# EAGLE design USBCastel (EAGLE 9.1.1)
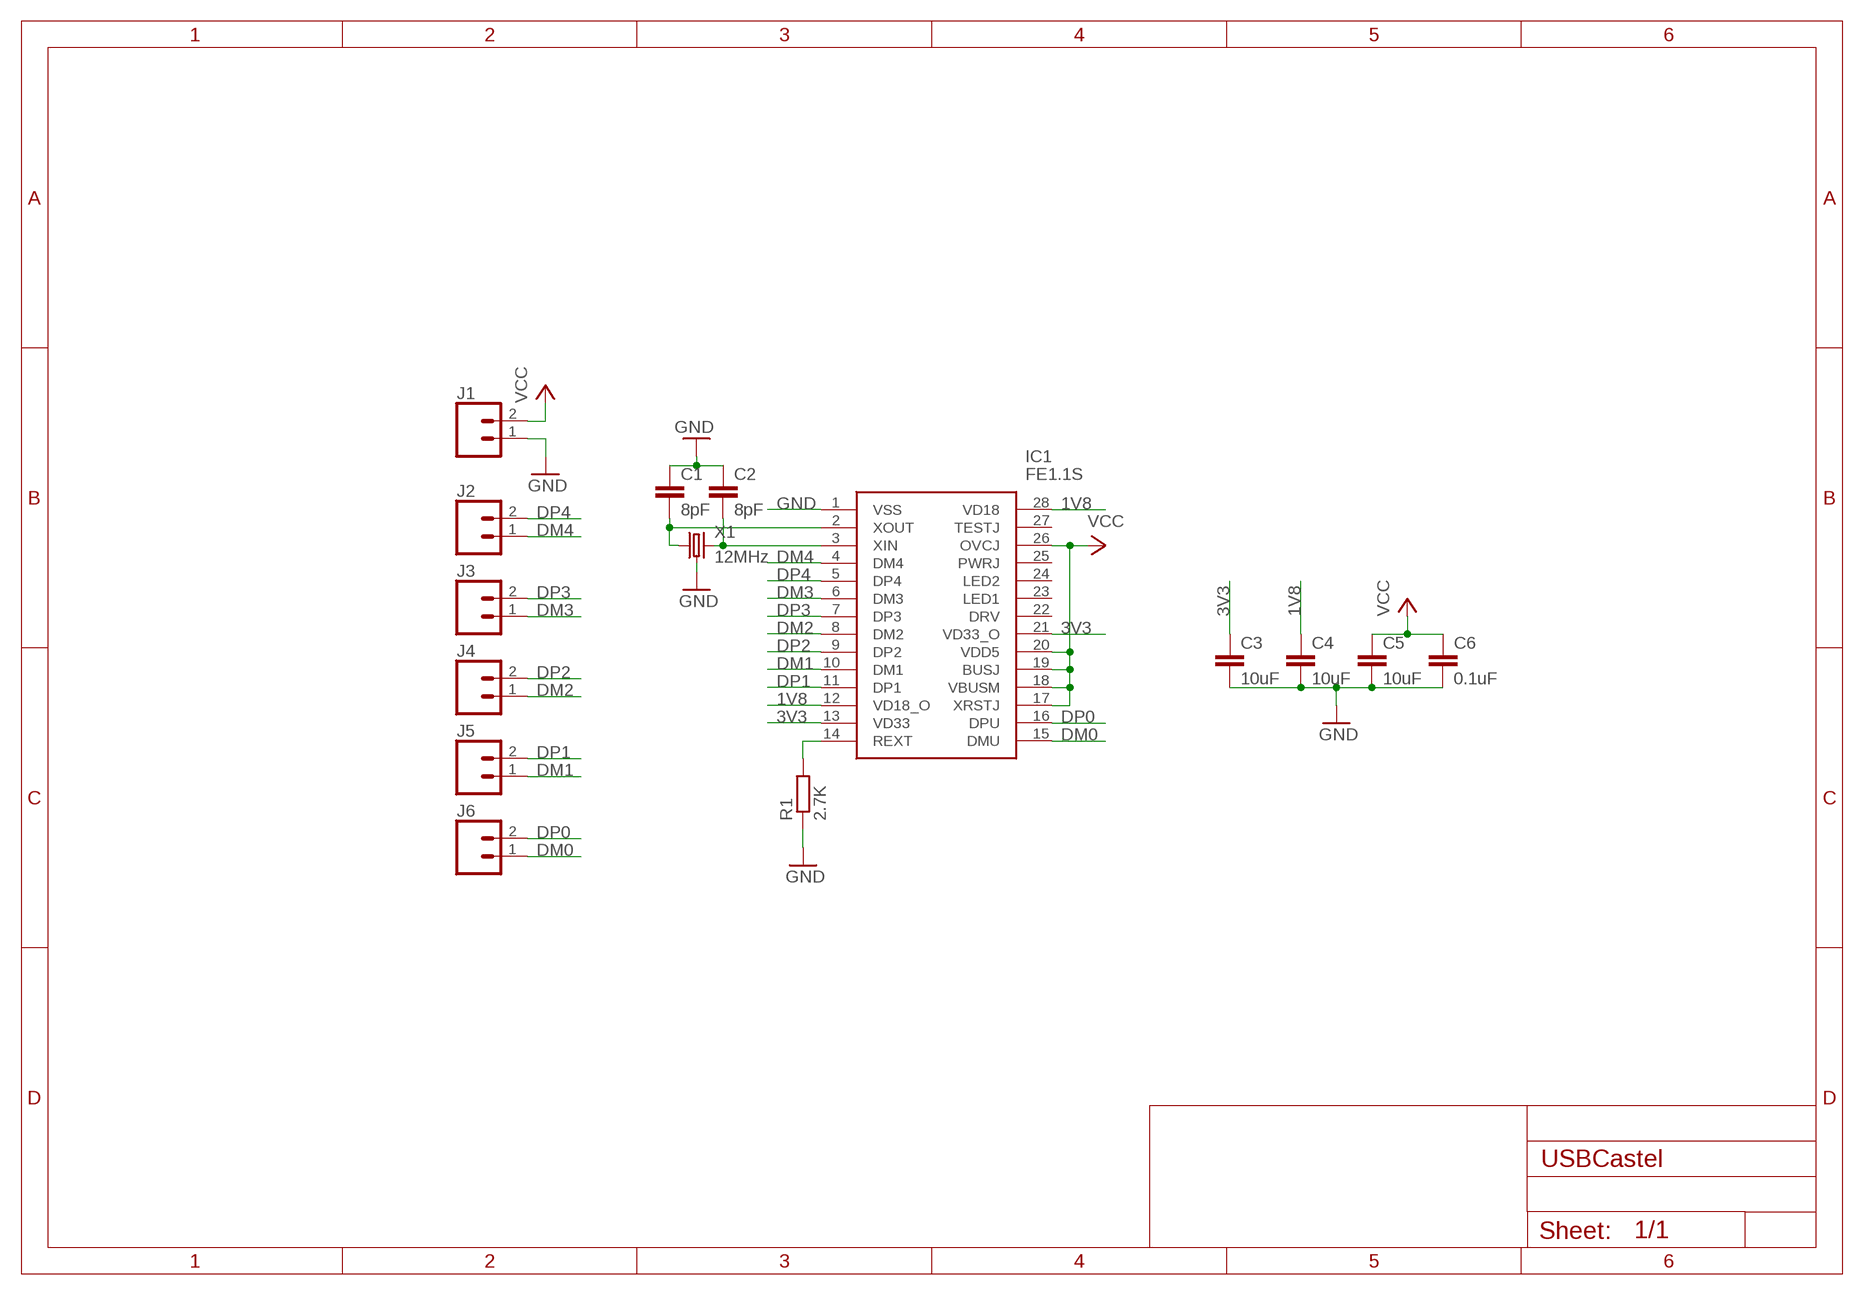
[diagram p0: schematic, sheet 1]

## Parts
C1  8pF  C-EUC0402  [C0402]
C2  8pF  C-EUC0402  [C0402]
C3  10uF  C-EUC0402  [C0402]
C4  10uF  C-EUC0402  [C0402]
C5  10uF  C-EUC0402  [C0402]
C6  0.1uF  C-EUC0402  [C0402]
IC1  FE1.1S  [SOP64P600X175-28N]
J1  CONN_021X02_NO_SILK  [1X02_NO_SILK]
J2  CONN_021X02_NO_SILK  [1X02_NO_SILK]
J3  CONN_021X02_NO_SILK  [1X02_NO_SILK]
J4  CONN_021X02_NO_SILK  [1X02_NO_SILK]
J5  CONN_021X02_NO_SILK  [1X02_NO_SILK]
J6  CONN_021X02_NO_SILK  [1X02_NO_SILK]
R1  2.7K  R-EU_R0402  [R0402]
X1  12MHz  ABM10  [ABM10]

## Nets
1V8: C4.1 IC1.12(VD18_O) IC1.28(VD18)
3V3: C3.1 IC1.13(VD33) IC1.21(VD33_O)
DM0: IC1.15(DMU) J6.1
DM1: IC1.10(DM1) J5.1
DM2: IC1.8(DM2) J4.1
DM3: IC1.6(DM3) J3.1
DM4: IC1.4(DM4) J2.1
DP0: IC1.16(DPU) J6.2
DP1: IC1.11(DP1) J5.2
DP2: IC1.9(DP2) J4.2
DP3: IC1.7(DP3) J3.2
DP4: IC1.5(DP4) J2.2
GND: C1.1 C2.1 C3.2 C4.2 C5.2 C6.2 IC1.1(VSS) J1.1 R1.1 X1.2 X1.4
N$1: C2.2 IC1.3(XIN) X1.3
N$2: C1.2 IC1.2(XOUT) X1.1
N$12: IC1.14(REXT) R1.2
VCC: C5.1 C6.1 IC1.17(XRSTJ) IC1.18(VBUSM) IC1.19(BUSJ) IC1.20(VDD5) IC1.26(OVCJ) J1.2
Unconnected: IC1.22(DRV) IC1.23(LED1) IC1.24(LED2) IC1.25(PWRJ) IC1.27(TESTJ)

## Library data of the parts
C1-C6 = rcl:C-EU: CAPACITOR, European symbol; SPICEPREFIX: C
IC1 = FE1.1S:FE1.1S: USB 2.0 HIGH SPEED 4-PORT HUB CONTROLLER Source: Datasheet <https://cdn-shop.adafruit.com/product-files/2991/FE1.1s Data Sheet (Rev. 1.0).pdf>; ARROW_PART_NUMBER: FE1.1S; DESCRIPTION: USB 2.0 HIGH SPEED 4-PORT HUB CONTROLLER; HEIGHT: 1.75mm; MANUFACTURER_NAME: JFD IC; MANUFACTURER_PART_NUMBER: FE1.1S
J1-J6 = SparkFun-Connectors:CONN_02: Multi connection point. Often used as Generic Header-pin footprint for 0.1 inch spaced/style header connections On any of the 0.1 inch spaced packages, you can populate with these: Break Away Headers - Straight <https://www.sparkfun.com/products/116> (PRT-00116) Break Away Male Headers - Right Angle <https://www.sparkfun.com/products/553> (PRT-00553) Female Headers <https://www.sparkfun.com/products/115> (PRT-00115) Break Away Headers - Machine Pin <https://www.sparkfun.com/products/117> (PRT-00117) Break Away Female Headers - Swiss Machine Pin <https://www.sparkfun.com/products/743> (PRT-00743) For SCREWTERMINALS and SPRING TERMINALS visit here: Screw Terimnals on SparkFun.com <https://www.sparkfun.com/search/results?term=Screw+Terminals> (5mm/3.5mm/2.54mm spacing) This device is also useful as a general connection point to wire up your design to another part of your project. Our various solder wires solder well into these plated through hole pads. Hook-Up Wire - Assortment (Stranded, 22 AWG) <https://www.sparkfun.com/products/11375> (PRT-11375) Hook-Up Wire - Assortment (Solid Core, 22 AWG) <https://www.sparkfun.com/products/11367> (PRT-11367) View the entire wire category on our website here <https://www.sparkfun.com/categories/141> Special notes: Molex polarized connector foot print use with: PRT-08233 with associated crimp pins and housings. 2.54_SCREWTERM for use with PRT-10571. 3.5mm Screw Terminal footprints for PRT-08084 5mm Screw Terminal footprints for use with PRT-08432
R1 = resistor:R-EU_: RESISTOR, European symbol
X1 = USBCastel:ABM10

## Board
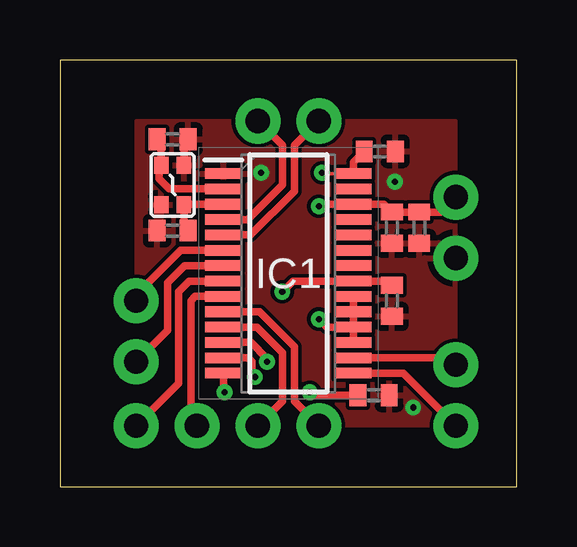
[diagram p1: board, top side]
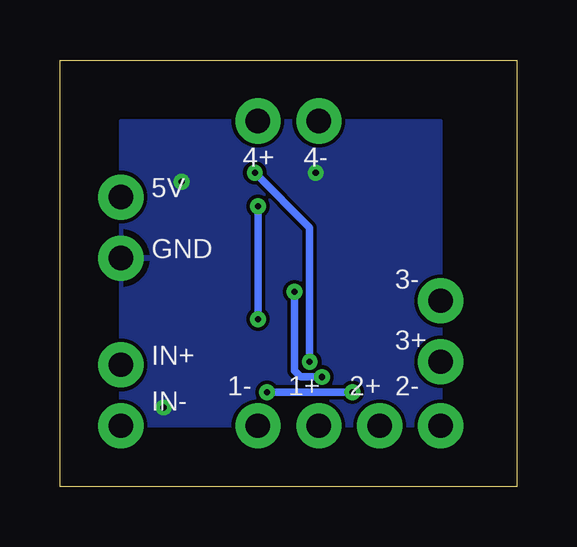
[diagram p2: board, bottom side, seen from below]

Size 19.05 x 17.78 mm. Coordinates in mm from the lower left corner, seen from the top.
Outline: 0,0 19.05,0 19.05,17.78 0,17.78 0,0
Copper layers (1*16): Top 0.035mm / dielectric 1.5mm / Bottom 0.035mm
Design rules "default": minimum track width 6mil, minimum drill 0.35mm, track to track 6mil, track to pad 6mil, pad to pad 6mil, via to via 6mil, smd to smd 6mil, copper to edge 40mil, drill to drill 6mil, minimum pad ring 10mil, minimum via ring 8mil, stop-mask expansion 4mil, vias tented up to drill 0mil, thermal gap 10mil

### Footprints (pad centres in the part's own frame; a part is rotated, then mirrored left to right if it is on the bottom)
C0402 = smd 0.7 x 0.9: 1 -0.65,0; 2 0.65,0
SOP64P600X175-28N = smd 1.525 x 0.44: 1 -2.712,4.16; 2 -2.712,3.52; 3 -2.712,2.88; 4 -2.712,2.24; 5 -2.712,1.6; 6 -2.712,0.96; 7 -2.712,0.32; 8 -2.712,-0.32; 9 -2.712,-0.96; 10 -2.712,-1.6; 11 -2.712,-2.24; 12 -2.712,-2.88; 13 -2.712,-3.52; 14 -2.712,-4.16; 15 2.712,-4.16; 16 2.712,-3.52; 17 2.712,-2.88; 18 2.712,-2.24; 19 2.712,-1.6; 20 2.712,-0.96; 21 2.712,-0.32; 22 2.712,0.32; 23 2.712,0.96; 24 2.712,1.6; 25 2.712,2.24; 26 2.712,2.88; 27 2.712,3.52; 28 2.712,4.16
1X02_NO_SILK = drill 1.016 pad 1.88: 1 0,0; 2 2.54,0
R0402 = smd 0.7 x 0.9: 1 -0.65,0; 2 0.65,0
ABM10 = smd 0.7 x 0.6: 1 -0.825,-0.475; 2 0.825,-0.475; 3 0.825,0.475; 4 -0.825,0.475

### Placement (x,y rotation side)
C1  4.7,14.48 180 top
C2  4.7,10.67 0 top
C3  13.84,7.75 270 top
C4  13.34,13.97 0 top
C5  13.84,10.79 270 top
C6  14.99,10.79 270 top
IC1  9.53,8.89 0 top
J1  16.51,9.53 90 top
J2  8.26,15.24 0 top
J3  3.17,7.75 270 top
J4  3.17,2.54 0 top
J5  10.79,2.54 180 top
J6  16.51,2.54 90 top
R1  13.08,3.81 180 top
X1  4.7,12.57 270 top

### Tracks (layer width: path | path; a pad name or v marks a point on that pad's centre or on a via)
1V8  (via drill 0.25)
  Top 0.152: v10.92,13.08 10.95,13.05 IC1.28
  Top 0.305: IC1.12 7.96,6.01 8.64,5.33 v8.64,5.21 | C4.1 12.24,13.52 IC1.28
  Bottom 0.305: v8.64,5.21 8.64,10.79 v10.92,13.08
3V3  (via drill 0.25)
  Top 0.152: C3.1 13.67,8.57
  Top 0.305: IC1.13 7.84,5.37 8,5.21 8,4.7 v8.13,4.57 | v9.27,8.13 9.71,8.57 IC1.21 13.67,8.57
  Bottom 0.305: v8.13,4.57 9.02,4.57 9.27,4.83 v9.27,8.13
DM0
  Top 0.305: J6.1 14.32,4.73 IC1.15
DM1
  Top 0.305: J5.1 9.78,3.56 9.78,5.84 8.33,7.29 IC1.10
DM2
  Top 0.305: J4.1 4.95,4.32 4.95,8.13 5.39,8.57 IC1.8
DM3
  Top 0.305: IC1.6 5.02,9.85 3.17,8 J3.1
DM4
  Top 0.203: 7.07,11.13 IC1.4
  Top 0.305: IC1.4 7.83,11.13 9.27,12.57 9.27,14.22 J2.1
DP0
  Top 0.305: IC1.16 16.22,5.37 J6.2
DP1
  Top 0.305: J5.2 9.27,3.56 9.27,5.59 8.21,6.65 IC1.11
DP2
  Top 0.305: J4.2 5.46,2.79 5.46,7.75 5.64,7.93 IC1.9
DP3
  Top 0.305: J3.2 4.5,6.53 4.5,8.51 5.2,9.21 IC1.7
DP4
  Top 0.305: J2.2 9.78,14.22 9.78,12.32 7.95,10.49 IC1.5
GND  (via drill 0.25)
  Top 0.305: C1.1 5.17,14.3 X1.4
  other vias: 14.73,3.3 13.97,12.7 8.38,13.08
  pour Top: 16.51,15.24 16.51,2.54 3.17,2.54 3.17,15.24
  pour Bottom: 3.17,15.24 16.51,15.24 16.51,2.54 3.17,2.54
N$1
  Top 0.152: X1.3 5.2,11.77
  Top 0.305: 5.2,11.77 IC1.3 | C2.2 5.17,10.84 X1.3
N$2
  Top 0.152: X1.1 4.14,13.31 | C1.2 4.22,14.3
  Top 0.305: 4.14,13.31 4.14,12.83 4.55,12.41 IC1.2 | 4.22,14.3 X1.1
N$12  (via drill 0.25)
  Top 0.305: v10.41,3.94 10.54,3.81 R1.2 | IC1.14 6.81,3.98 v6.86,3.94
  Bottom 0.305: v6.86,3.94 v10.41,3.94
VCC  (via drill 0.25)
  Top 0.305: J1.2 15.89,11.45 C6.1 C5.1 13.52,11.77 IC1.26 10.88,11.77 v10.79,11.68 | IC1.17 IC1.18 | IC1.18 IC1.19 IC1.20 | v10.79,6.99 11.13,6.65 IC1.18
  Bottom 0.305: v10.79,11.68 v10.79,6.99

### Text on the board
bPlace: 4- | 4+ | 5V | GND | 3- | 3+ | IN+ | 2- | 2+ | 1+ | 1- | IN-